# Altium schematic sheet Sheet_1_2020-07-29_17-40-03.schdoc
size 233 x 149 mm
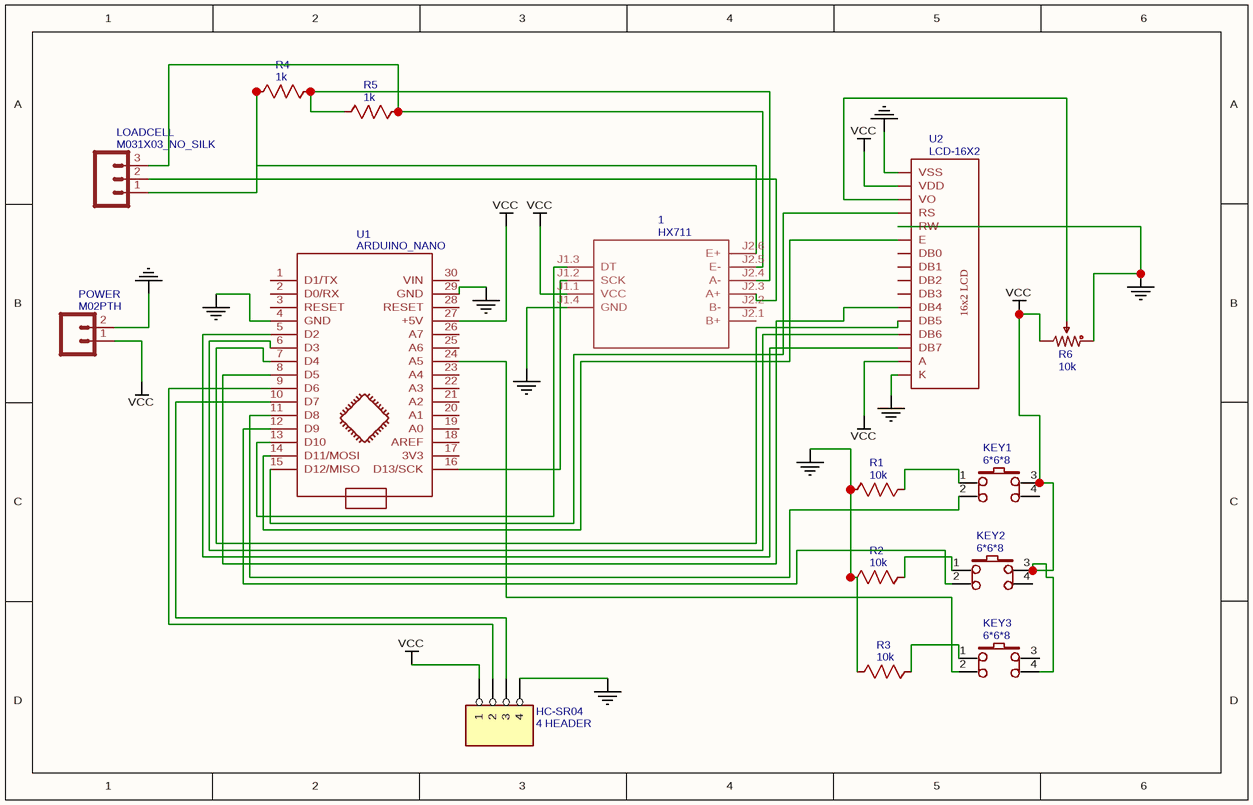
[diagram p0: Sheet_1_2020-07-29_17-40-03.schdoc]

## Parts
1  HX711  [HX711]
HC-SR04  4 HEADER  [HEADER4]
KEY1  6*6*8  [KEY-6.0*6.0-2]
KEY2  6*6*8  [KEY-6.0*6.0-2]
KEY3  6*6*8  [KEY-6.0*6.0-2]
LOADCELL  M031X03_NO_SILK  [1X03_NO_SILK]
POWER  M02PTH  [1X02]
R1  10k  [AXIAL-0.3]
R2  10k  [AXIAL-0.3]
R3  10k  [AXIAL-0.3]
R4  1k  [AXIAL-0.3]
R5  1k  [AXIAL-0.3]
R6  10k  [RES-ADJ_3386P]
U1  ARDUINO_NANO  [ARDUINO_NANO]
U2  LCD-16X2  [LCD-16X2]

## Nets
GND: 1.J1.4(GND) HC-SR04.4 POWER.2 R1.1 R2.1 R3.1 R6.1 U1.4(GND) U1.29(GND) U2.1(VSS) U2.5(RW) U2.16(K)
VCC: 1.J1.1(VCC) HC-SR04.1 KEY1.3 KEY2.3 KEY3.4 POWER.1 R6.3 U1.27(+5V) U2.2(VDD) U2.15(A)
Net1_J1.2: 1.J1.2(SCK) U1.16(D13/SCK)
Net1_J1.3: 1.J1.3(DT) U1.13(D10)
Net1_J2.3: 1.J2.3(A+) LOADCELL.2
Net1_J2.4: 1.J2.4(A-) R4.2 R5.1
Net1_J2.5: 1.J2.5(E-) LOADCELL.3 R5.2
Net1_J2.6: 1.J2.6(E+) LOADCELL.1 R4.1
NetHC-SR04_2: HC-SR04.2 U1.9(D6)
NetHC-SR04_3: HC-SR04.3 U1.10(D7)
NetKEY1_1: KEY1.1 R1.2
NetKEY1_2: KEY1.2 U1.11(D8)
NetKEY2_1: KEY2.1 R2.2
NetKEY2_2: KEY2.2 U1.12(D9)
NetKEY3_1: KEY3.1 R3.2
NetKEY3_2: KEY3.2 U1.24(A5)
NetR6_2: R6.2 U2.3(VO)
NetU1_5: U1.5(D2) U2.14(DB7)
NetU1_6: U1.6(D3) U2.13(DB6)
NetU1_7: U1.7(D4) U2.12(DB5)
NetU1_8: U1.8(D5) U2.11(DB4)
NetU1_14: U1.14(D11/MOSI) U2.6(E)
NetU1_15: U1.15(D12/MISO) U2.4(RS)

Not connected (* = marked no-connect by the designer): 1 J2.1(B+) J2.2(B-); KEY1 4; KEY2 4; KEY3 3; U1 1(D1/TX) 2(D0/RX) 3(RESET) 17(3V3) 18(AREF) 19(A0) 20(A1) 21(A2) 22(A3) 23(A4) 25(A6) 26(A7) 28(RESET) 30(VIN); U2 7(DB0) 8(DB1) 9(DB2) 10(DB3)

## Notes on the sheet
- (in symbol LCD-16X2) 16x2 LCD

## Library data of the parts
1 = HX711: Contributor: Krzysztof Handzlik; BOM_Manufacturer Part: ?; spicePre: ?
HC-SR04 = 4 HEADER: description: 4 Pin Header; timeStamp: 1453256398; BOM_Manufacturer Part: ?; spicePre: J
KEY1-KEY3 = 6*6*8: BOM_Manufacturer: ReliaPro; BOM_Manufacturer Part: button6*6*8; BOM_Supplier Part: C59982; BOM_Supplier: LCSC; spicePre: K
LOADCELL = M031X03_NO_SILK: description: Header 3; timeStamp: 1474825470; BOM_Manufacturer Part: ?; spicePre: J
POWER = M02PTH: description: Header 2; timeStamp: 1461766410; BOM_Manufacturer Part: ?; spicePre: J
R1-R3 = 10k: nameAlias: Value(Ω); BOM_Manufacturer Part: ?; spicePre: R; spiceSymbolName: Res_AXIAL-0.3(1/8W)_US
R4 R5 = 1k: nameAlias: Value(Ω); BOM_Manufacturer Part: ?; spicePre: R; spiceSymbolName: Res_AXIAL-0.3(1/8W)_US
R6 = 10k: BOM_Manufacturer: Bochen; BOM_Manufacturer Part: 3386P-1-101LF; nameAlias: Resistance(Ohms); Contributor: EasyEDA; BOM_Supplier: LCSC; BOM_Supplier Part: C125022; spicePre: R; spiceSymbolName: 3386P-1-101LF_US
U1 = ARDUINO_NANO: sourceId: KGSeAWhDB; timeStamp: 1452340004; BOM_Manufacturer Part: ?; spicePre: U
U2 = LCD-16X2: Contributor: SparkFun; BOM_Manufacturer Part: ?; spicePre: U